# EAGLE design M119 (EAGLE 6.6.0)
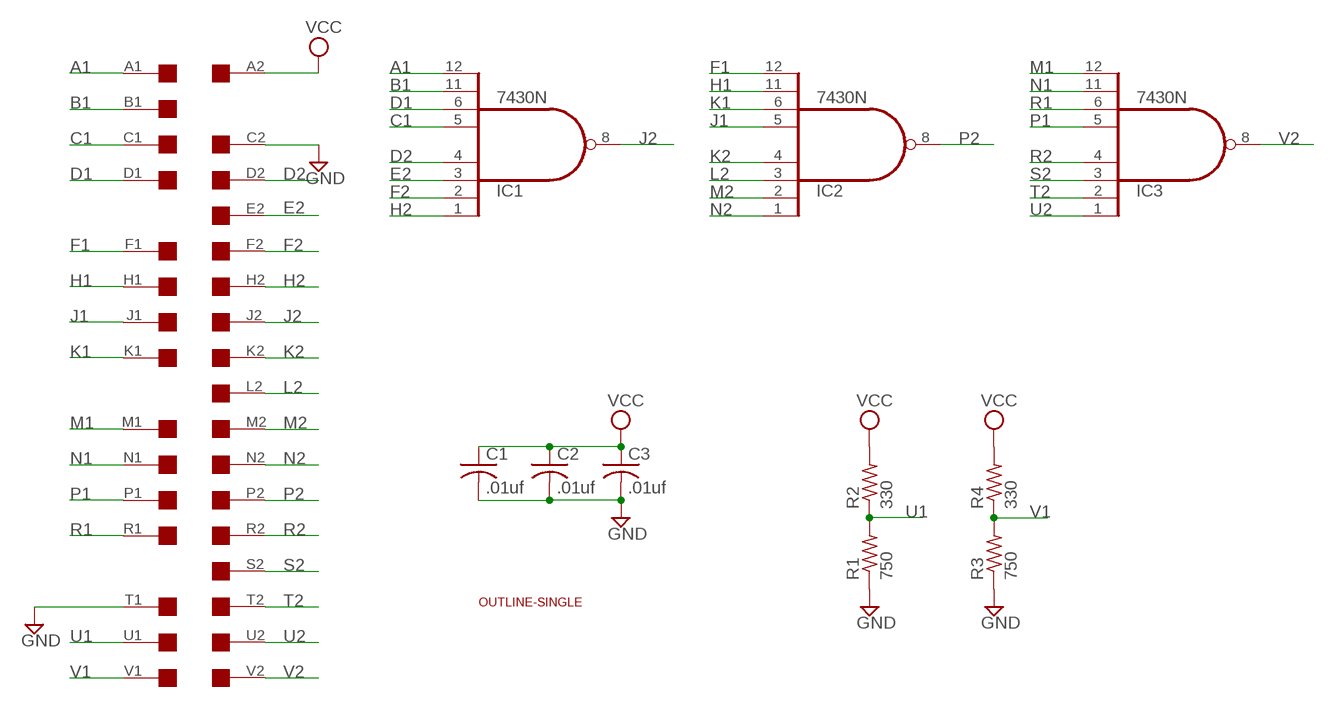
[diagram p0: schematic, sheet 1]

## Parts
C1  .01uf  C-US050-025X075  [C050-025X075]
C2  .01uf  C-US050-025X075  [C050-025X075]
C3  .01uf  C-US050-025X075  [C050-025X075]
IC1  7430N  [DIL14]
IC2  7430N  [DIL14]
IC3  7430N  [DIL14]
R1  750  R-US_0207/10  [0207/10]
R2  330  R-US_0207/10  [0207/10]
R3  750  R-US_0207/10  [0207/10]
R4  330  R-US_0207/10  [0207/10]
U$1  OUTLINE-SINGLE  [SINGLE]
U$4  SINGLE  [EDGE-CON2]

## Nets
A1: IC1.12(I7) U$4.A1
B1: IC1.11(I6) U$4.B1
C1: IC1.5(I4) U$4.C1
D1: IC1.6(I5) U$4.D1
D2: IC1.4(I3) U$4.D2
E2: IC1.3(I2) U$4.E2
F1: IC2.12(I7) U$4.F1
F2: IC1.2(I1) U$4.F2
GND: C1.2 C2.2 C3.2 R1.1 R3.1 U$4.C2 U$4.T1
H1: IC2.11(I6) U$4.H1
H2: IC1.1(I0) U$4.H2
J1: IC2.5(I4) U$4.J1
J2: IC1.8(O) U$4.J2
K1: IC2.6(I5) U$4.K1
K2: IC2.4(I3) U$4.K2
L2: IC2.3(I2) U$4.L2
M1: IC3.12(I7) U$4.M1
M2: IC2.2(I1) U$4.M2
N1: IC3.11(I6) U$4.N1
N2: IC2.1(I0) U$4.N2
P1: IC3.5(I4) U$4.P1
P2: IC2.8(O) U$4.P2
R1: IC3.6(I5) U$4.R1
R2: IC3.4(I3) U$4.R2
S2: IC3.3(I2) U$4.S2
T2: IC3.2(I1) U$4.T2
U1: R1.2 R2.1 U$4.U1
U2: IC3.1(I0) U$4.U2
V1: R3.2 R4.1 U$4.V1
V2: IC3.8(O) U$4.V2
VCC: C1.1 C2.1 C3.1 R2.2 R4.2 U$4.A2
Unconnected: U$4.B2 U$4.E1 U$4.L1 U$4.S1

## Power pins joined to a net without a drawn wire
GND: IC1.7(GND) IC2.7(GND) IC3.7(GND)
VCC: IC1.14(VCC) IC2.14(VCC) IC3.14(VCC)

## Library data of the parts
C1-C3 = rcl:C-US: CAPACITOR, American symbol
IC1-IC3 = 74xx-us:74*30: 8-input NAND gate
R1-R4 = rcl:R-US_: RESISTOR, American symbol
U$1 = dec-con:OUTLINE-*: Board outlines for DEC boards.
U$4 = dec-con:SINGLE: Single-Height DEC board

## Board
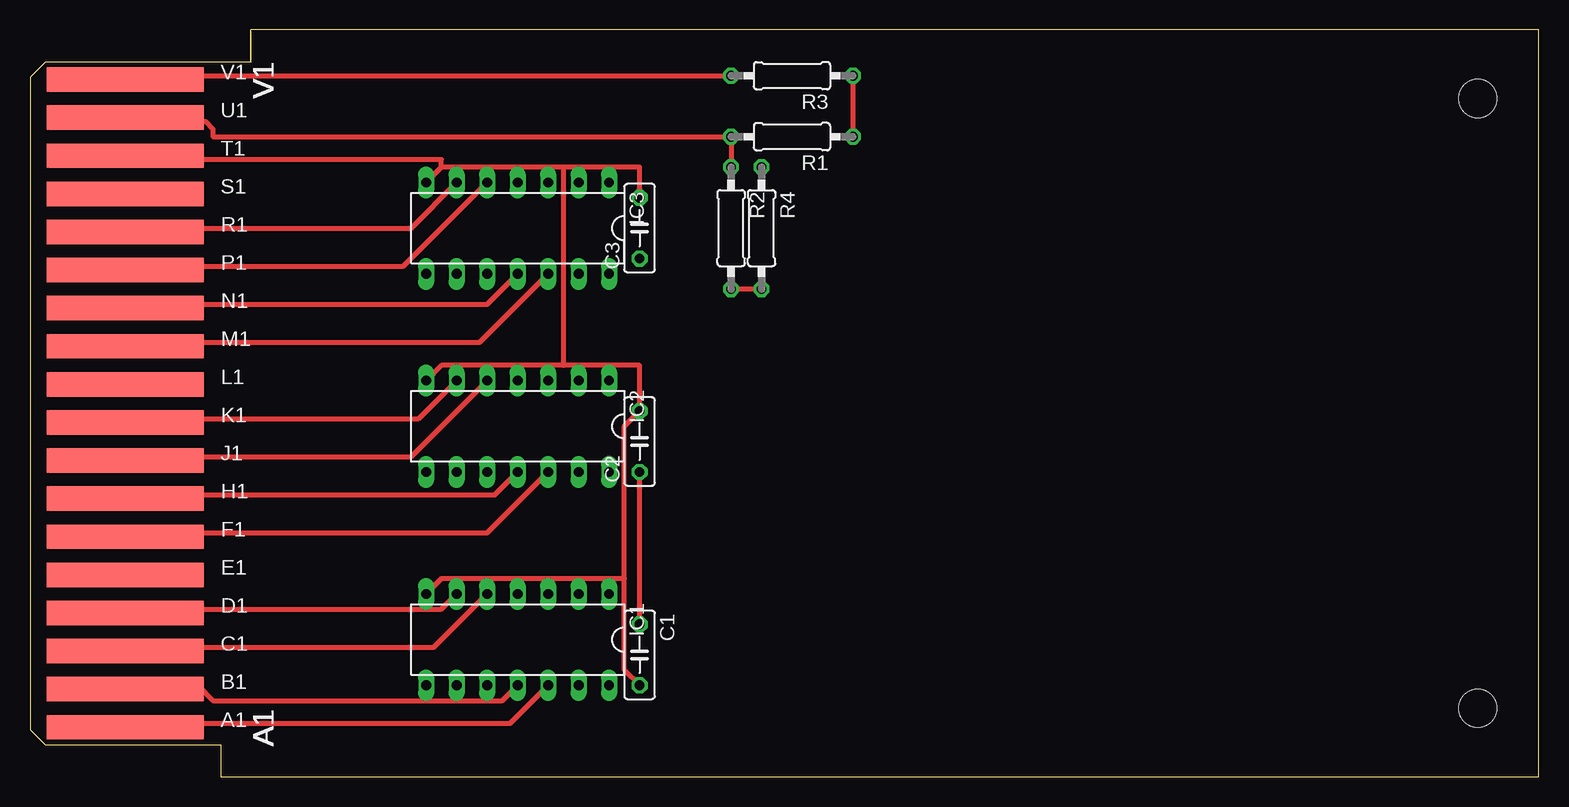
[diagram p1: board, top side]
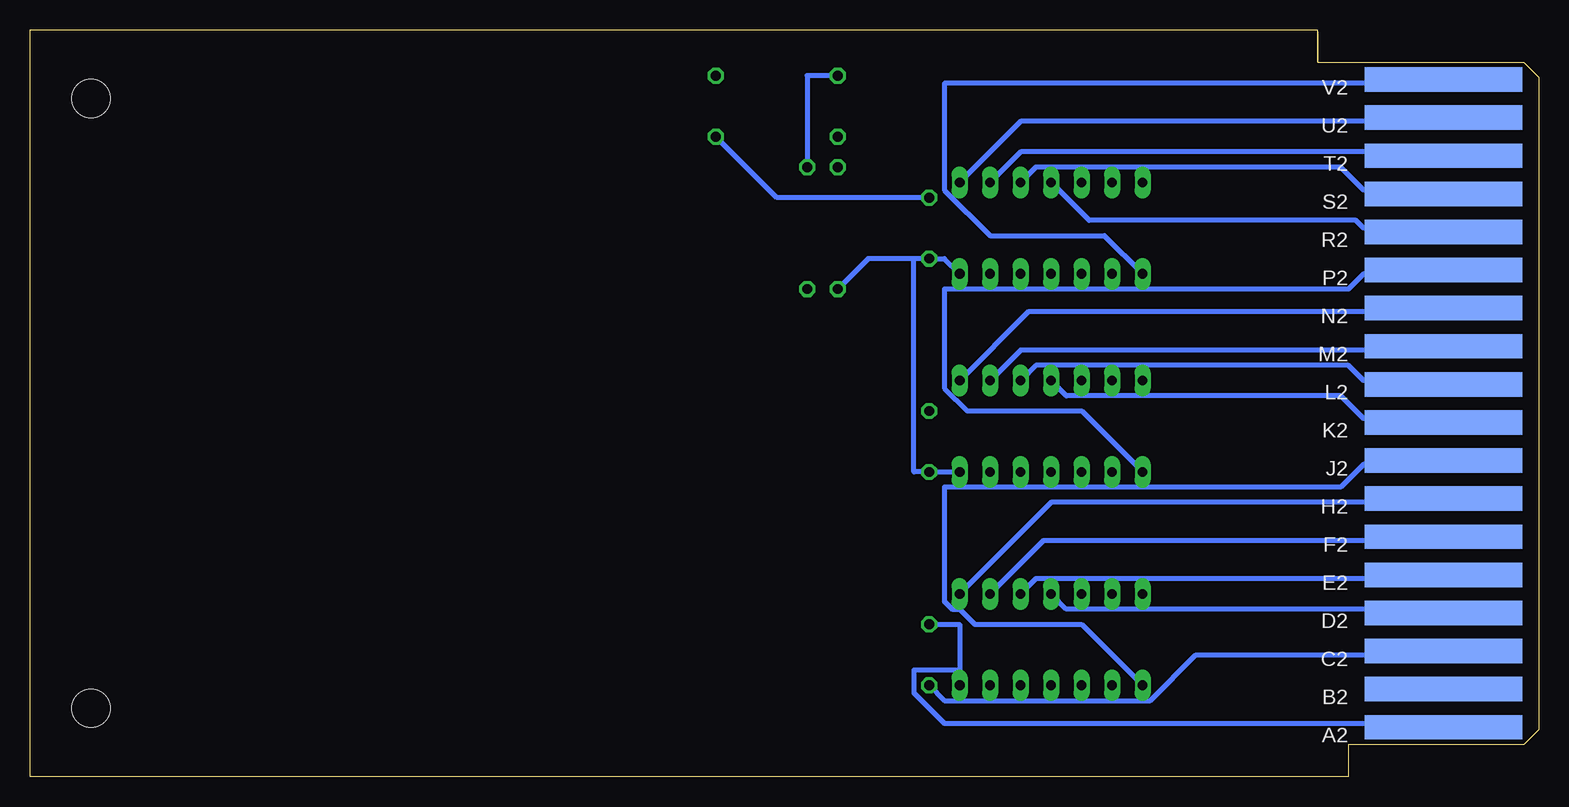
[diagram p2: board, bottom side, seen from below]

Size 125.73 x 62.23 mm. Coordinates in mm from the lower left corner, seen from the top.
Copper layers (1+16): Top 0.035mm / dielectric 1.5mm / Bottom 0.035mm
Design rules "16mils": minimum track width 16mil, minimum drill 32mil, track to track 15mil, track to pad 10mil, pad to pad 10mil, via to via 10mil, smd to smd 10mil, copper to edge 13mil, drill to drill 10mil, minimum pad ring 10mil, minimum via ring 8mil, stop-mask expansion 0mil, vias tented up to drill 0mil, thermal gap 10mil

### Footprints (pad centres in the part's own frame; a part is rotated, then mirrored left to right if it is on the bottom)
C050-025X075 = drill 0.813 octagon: 1 -2.54,0; 2 2.54,0
DIL14 = drill 0.813 long: 1 -7.62,-3.81; 2 -5.08,-3.81; 3 -2.54,-3.81; 4 0,-3.81; 5 2.54,-3.81; 6 5.08,-3.81; 7 7.62,-3.81; 8 7.62,3.81; 9 5.08,3.81; 10 2.54,3.81; 11 0,3.81; 12 -2.54,3.81; 13 -5.08,3.81; 14 -7.62,3.81
0207/10 = drill 0.813 octagon: 1 -5.08,0; 2 5.08,0
SINGLE = hole 3.175: 120.65,56.515; 120.65,5.715
EDGE-CON2 = smd 13.106 x 2.032: A1 7.938,4.128; B1 7.938,7.303; C1 7.938,10.477; D1 7.938,13.652; E1 7.938,16.828; F1 7.938,20.003; H1 7.938,23.177; J1 7.938,26.352; K1 7.938,29.527; L1 7.938,32.703; M1 7.938,35.877; N1 7.938,39.053; P1 7.938,42.227; R1 7.938,45.403; S1 7.938,48.578; T1 7.938,51.752; U1 7.938,54.928; V1 7.938,58.102 | smd 13.106 x 2.032 bottom: A2 7.938,4.128; B2 7.938,7.303; C2 7.938,10.477; D2 7.938,13.652; E2 7.938,16.828; F2 7.938,20.003; H2 7.938,23.177; J2 7.938,26.352; K2 7.938,29.527; L2 7.938,32.703; M2 7.938,35.877; N2 7.938,39.053; P2 7.938,42.227; R2 7.938,45.403; S2 7.938,48.578; T2 7.938,51.752; U2 7.938,54.928; V2 7.938,58.102

### Placement (x,y rotation side)
C1  50.8,10.16 270 top
C2  50.8,27.94 90 top
C3  50.8,45.72 90 top
IC1  40.64,11.43 180 top
IC2  40.64,29.21 180 top
IC3  40.64,45.72 180 top
R1  63.5,53.34 180 top
R2  58.42,45.72 270 top
R3  63.5,58.42 180 top
R4  60.96,45.72 270 top
U$1  0,0 0 top
U$4  0,0 0 top

### Tracks (layer width: path | path; a pad name or v marks a point on that pad's centre or on a via)
A1
  Top 0.406: IC1.12 40.01,4.45 8.26,4.45 U$4.A1
B1
  Top 0.406: IC1.11 39.37,6.35 15.24,6.35 13.97,7.62 8.26,7.62 U$4.B1
C1
  Top 0.406: IC1.5 33.66,10.79 8.26,10.79 U$4.C1
D1
  Top 0.406: IC1.6 34.29,13.97 8.26,13.97 U$4.D1
D2
  Bottom 0.406: IC1.4 39.37,13.97 8.26,13.97 U$4.D2
E2
  Bottom 0.406: IC1.3 41.91,16.51 8.26,16.51 U$4.E2
F1
  Top 0.406: IC2.12 38.1,20.32 8.26,20.32 U$4.F1
F2
  Bottom 0.406: IC1.2 41.28,19.68 8.26,19.68 U$4.F2
GND
  Top 0.406: IC2.7 34.29,34.29 44.45,34.29 | 44.45,34.29 50.8,34.29 C2.2 49.53,29.21 49.53,16.51 | IC1.7 34.29,16.51 49.53,16.51 | 49.53,16.51 49.53,8.89 C1.2 | R3.1 R1.1 | 34.29,50.8 IC3.7 | 44.45,50.8 50.8,50.8 C3.2 | 44.45,50.8 34.29,50.8 | 34.29,50.8 34.29,51.44 8.26,51.44 U$4.T1 | 44.45,50.8 44.45,34.29
  Bottom 0.406: C1.2 49.53,6.35 32.39,6.35 28.58,10.16 8.26,10.16 U$4.C2 | R1.1 63.5,48.26 C3.2
H1
  Top 0.406: IC2.11 38.74,23.5 8.26,23.5 U$4.H1
H2
  Bottom 0.406: IC1.1 40.64,22.86 8.26,22.86 U$4.H2
J1
  Top 0.406: IC2.5 31.75,26.67 8.26,26.67 U$4.J1
J2
  Bottom 0.406: IC1.8 38.1,12.7 46.99,12.7 48.26,13.97 48.9,13.97 49.53,14.61 49.53,24.13 16.51,24.13 14.61,26.04 8.26,26.04 U$4.J2
K1
  Top 0.406: IC2.6 32.39,29.84 8.26,29.84 U$4.K1
K2
  Bottom 0.406: IC2.4 39.37,31.75 16.51,31.75 14.61,29.84 8.26,29.84 U$4.K2
L2
  Bottom 0.406: IC2.3 41.91,34.29 15.88,34.29 14.61,33.02 8.26,33.02 U$4.L2
M1
  Top 0.406: IC3.12 37.47,36.2 8.26,36.2 U$4.M1
M2
  Bottom 0.406: IC2.2 43.18,35.56 8.26,35.56 U$4.M2
N1
  Top 0.406: IC3.11 38.1,39.37 8.26,39.37 U$4.N1
N2
  Bottom 0.406: IC2.1 42.55,38.73 8.26,38.73 U$4.N2
P1
  Top 0.406: IC3.5 31.12,42.55 8.26,42.55 U$4.P1
P2
  Bottom 0.406: IC2.8 38.1,30.48 47.63,30.48 49.53,32.38 49.53,40.64 15.88,40.64 14.61,41.91 8.26,41.91 U$4.P2
R1
  Top 0.406: IC3.6 31.75,45.72 8.26,45.72 U$4.R1
R2
  Bottom 0.406: IC3.4 37.47,46.35 15.24,46.35 14.61,45.72 8.26,45.72 U$4.R2
S2
  Bottom 0.406: IC3.3 41.91,50.8 16.51,50.8 14.61,48.9 8.26,48.9 U$4.S2
T2
  Bottom 0.406: IC3.2 43.18,52.07 8.26,52.07 U$4.T2
U1
  Top 0.406: R2.1 R1.2 15.24,53.34 15.24,53.98 14.61,54.61 8.26,54.61 U$4.U1
U2
  Bottom 0.406: IC3.1 43.18,54.61 8.26,54.61 U$4.U2
V1
  Top 0.406: R3.2 8.26,58.42 U$4.V1
  Bottom 0.406: R4.1 60.96,58.42 R3.2
V2
  Bottom 0.406: IC3.8 36.2,45.09 45.72,45.09 49.53,48.9 49.53,57.78 8.26,57.78 U$4.V2
VCC
  Top 0.406: R4.2 R2.2 | C1.1 C2.1
  Bottom 0.406: IC3.14 49.53,43.18 C3.1 52.07,43.18 | R2.2 55.88,43.18 52.07,43.18 | IC2.14 C2.1 52.07,25.4 52.07,43.18 | 48.26,8.89 48.26,12.7 C1.1 | 48.26,8.89 IC1.14 | 48.26,8.89 52.07,8.89 52.07,6.99 49.53,4.45 8.26,4.45 U$4.A2

### Text on the board
tNames: V1 | V1 | V1 | V1 | V1 | V1 | V1 | V1 | V1 | V1 | V1 | V1 | V1 | V1 | V1 | V1 | V1 | V1 | V1 | V1 | V1 | V1 | V1 | V1 | V1 | V1 | V1 | V1 | V1 | V1 | V1 | V1 | A1 | A1 | A1 | A1 | A1 | A1 | A1 | A1 | A1 | A1 | A1 | A1 | A1 | A1 | A1 | A1 | A1 | A1 | A1 | A1 | A1 | A1 | A1 | A1 | A1 | A1 | A1 | A1 | A1 | A1 | A1 | A1